# EAGLE schematic lcd (EAGLE 9.6.2)
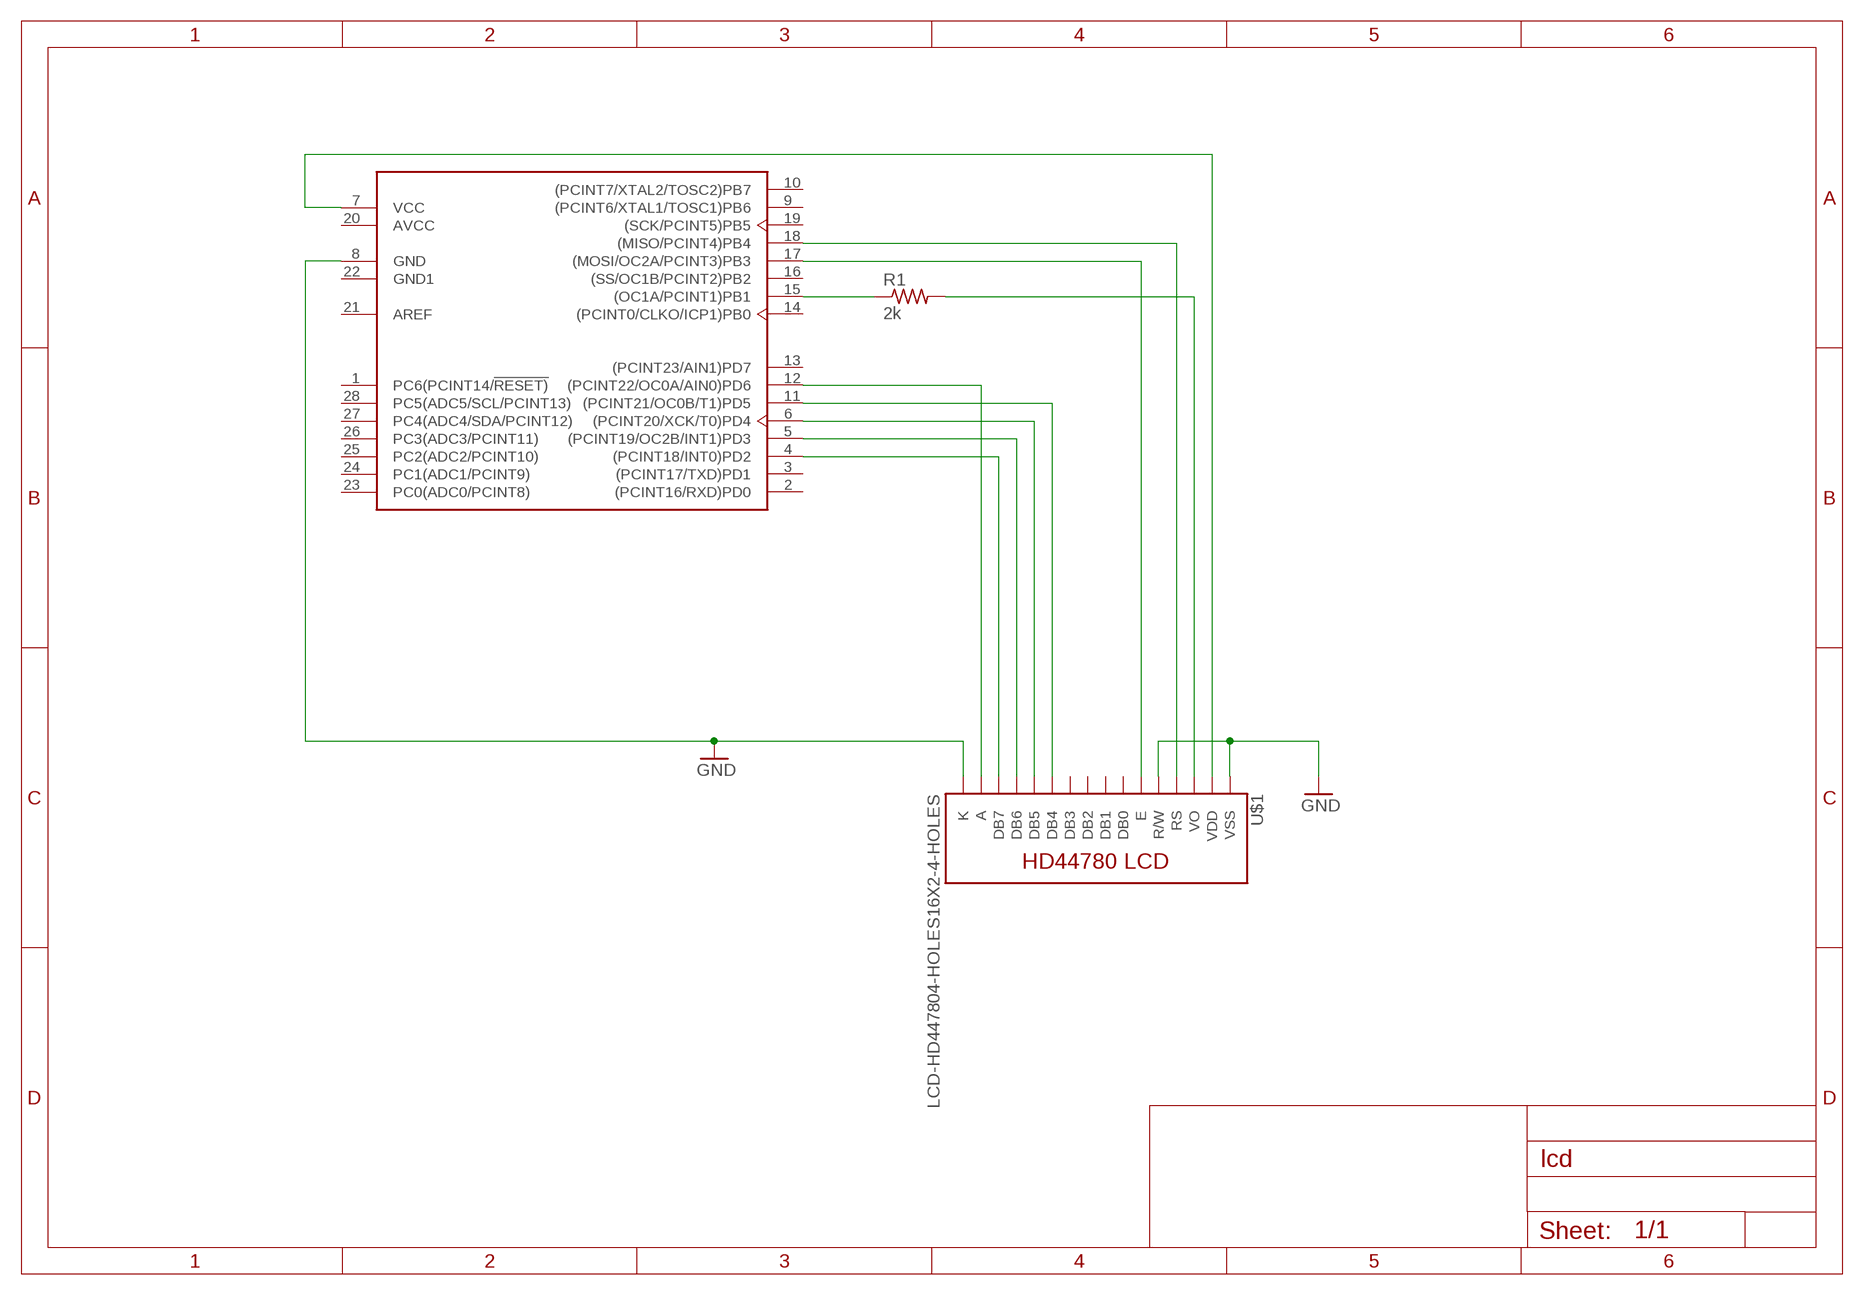
[diagram p0: schematic, sheet 1]

## Parts
R1  2k  R-US_0204/2V  [0204V]
U1  ATMEGA328P-PU  [DIP-28]
U$1  LCD-HD447804-HOLES16X2-4-HOLES  [LCD-16X2-4HOLES]

## Nets
GND: U1.8(GND) U$1.1(VSS) U$1.5(R/W) U$1.16(K)
N$1: U1.18((MISO/PCINT4)PB4) U$1.4(RS)
N$2: U1.17((MOSI/OC2A/PCINT3)PB3) U$1.6(E)
N$3: R1.1 U1.15((OC1A/PCINT1)PB1)
N$4: R1.2 U$1.3(VO)
N$5: U1.12((PCINT22/OC0A/AIN0)PD6) U$1.15(A)
N$6: U1.11((PCINT21/OC0B/T1)PD5) U$1.11(DB4)
N$7: U1.6((PCINT20/XCK/T0)PD4) U$1.12(DB5)
N$8: U1.5((PCINT19/OC2B/INT1)PD3) U$1.13(DB6)
N$9: U1.4((PCINT18/INT0)PD2) U$1.14(DB7)
N$10: U1.7(VCC) U$1.2(VDD)
Unconnected: U1.1(PC6(PCINT14/!RESET)) U1.2((PCINT16/RXD)PD0) U1.3((PCINT17/TXD)PD1) U1.9((PCINT6/XTAL1/TOSC1)PB6) U1.10((PCINT7/XTAL2/TOSC2)PB7) U1.13((PCINT23/AIN1)PD7) U1.14((PCINT0/CLKO/ICP1)PB0) U1.16((SS/OC1B/PCINT2)PB2) U1.19((SCK/PCINT5)PB5) U1.21(AREF) U1.23(PC0(ADC0/PCINT8)) U1.24(PC1(ADC1/PCINT9)) U1.25(PC2(ADC2/PCINT10)) U1.26(PC3(ADC3/PCINT11)) U1.27(PC4(ADC4/SDA/PCINT12)) U1.28(PC5(ADC5/SCL/PCINT13)) U$1.7(DB0) U$1.8(DB1) U$1.9(DB2) U$1.10(DB3)

## Power pins joined to a net without a drawn wire
AVCC: U1.20(AVCC)
GND1: U1.22(GND1)

## Library data of the parts
R1 = rcl:R-US_: RESISTOR, American symbol; SPICEPREFIX: R
U1 = Microcontroller:ATMEGA328P-PU: IC MCU 8BIT 32KB FLASH 28DIP Manufacturer's datasheet <http://ww1.microchip.com/downloads/en/DeviceDoc/ATmega48A-PA-88A-PA-168A-PA-328-P-DS-DS40002061A.pdf>; CREATED_BY: PCBLayout.com; DIGIKEY_PART_NUMBER: ATMEGA328P-PU-ND; MANUFACTURER: Microchip Technology; MPN: ATMEGA328P-PU; PACKAGE: DIP-28
U$1 = HD44780LCD:LCD-HD44780

## Module ARDUINO
Ports: 

### Library data of the parts